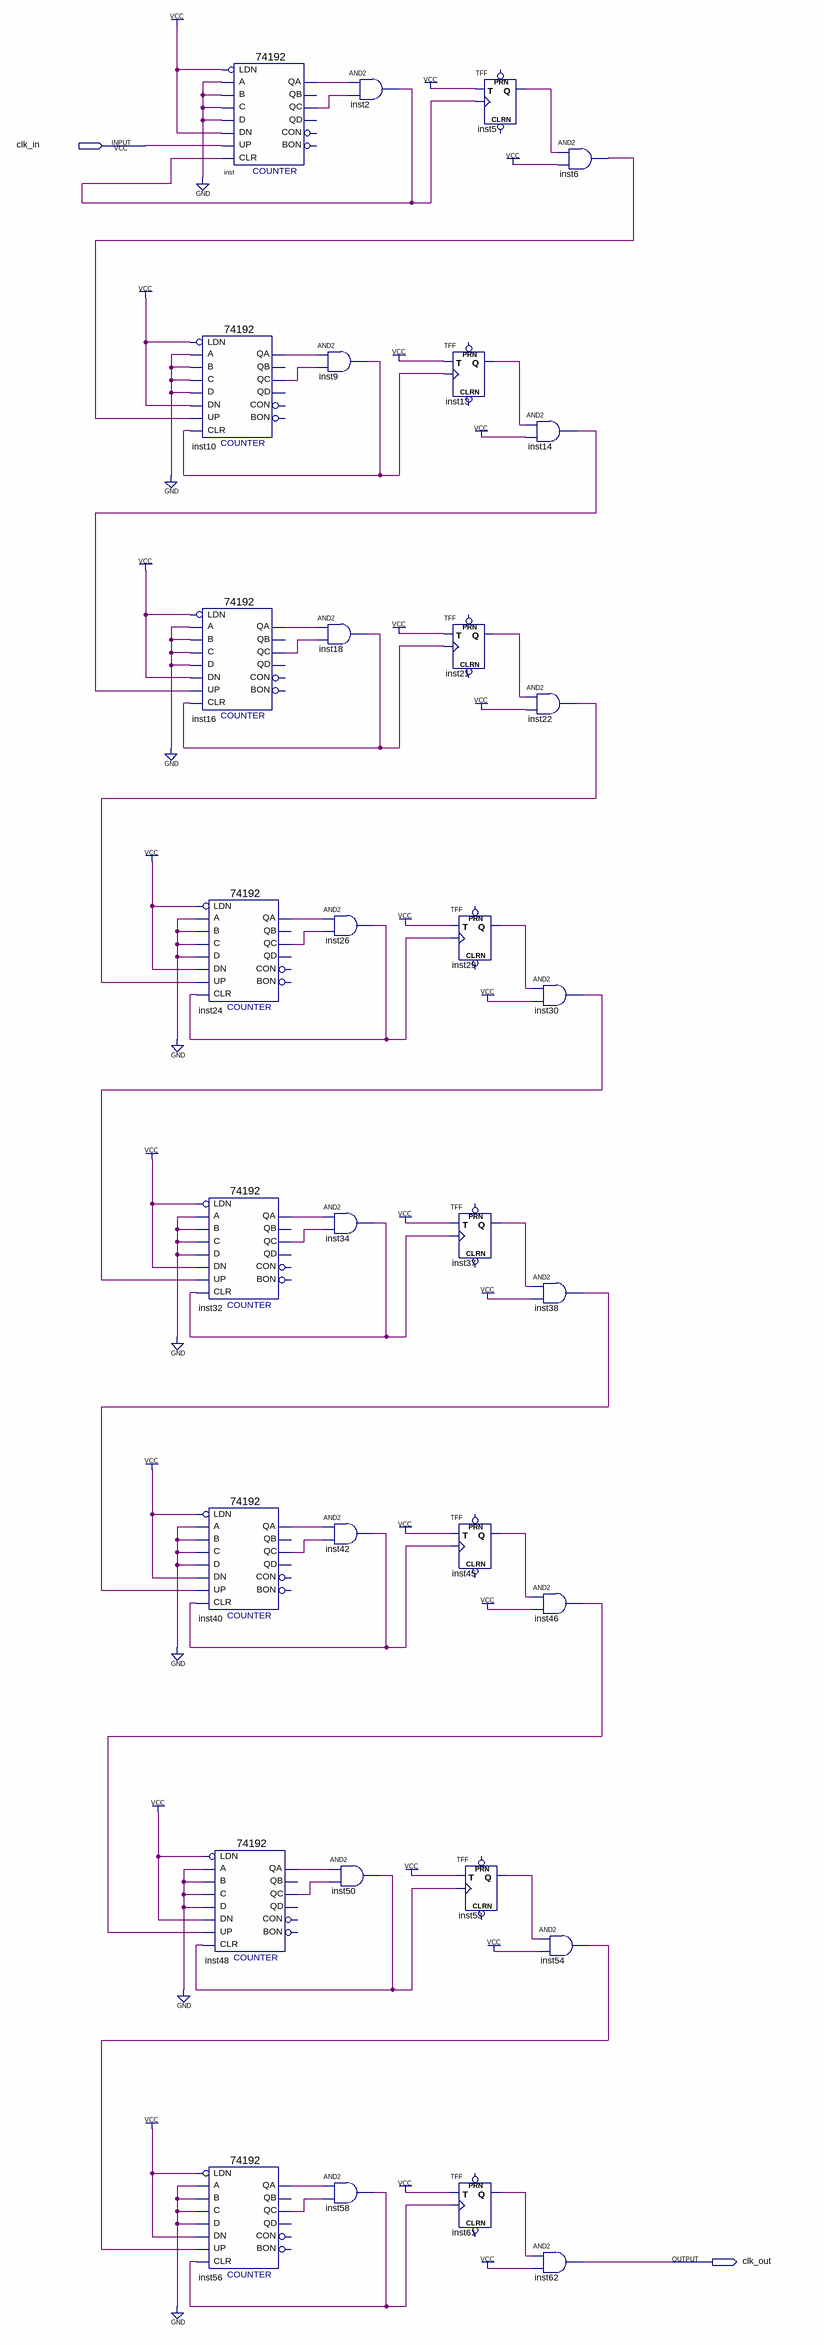
[diagram p0: schematic sheet]
// Quartus schematic fenpin.bdf as structural Verilog: 32 symbols, 2 pins
module fenpin (
  input  clk_in,
  output clk_out
);

  wire inst2_out, inst5_q, inst6_out, inst9_out, inst10_qa, inst10_qc, inst13_q, inst14_out, inst16_qa,
       inst16_qc, inst18_out, inst21_q, inst22_out, inst24_qa, inst24_qc, inst26_out, inst29_q, inst30_out,
       inst32_qa, inst32_qc, inst34_out, inst37_q, inst38_out, inst40_qa, inst40_qc, inst42_out, inst45_q,
       inst46_out, inst48_qa, inst48_qc, inst50_out, inst53_q, inst54_out, inst56_qa, inst56_qc, inst58_out,
       inst61_q, inst_qa, inst_qc;

  \74192  inst (
    .D(1'b0), .C(1'b0), .A(1'b0), .B(1'b0), .CLR(inst2_out), .UP(clk_in), .DN(1'b1), .LDN(1'b1),
    .QA(inst_qa), .QC(inst_qc));  // open: QB, BON, CON, QD
  \74192  inst10 (
    .D(1'b0), .C(1'b0), .A(1'b0), .B(1'b0), .CLR(inst9_out), .UP(inst6_out), .DN(1'b1), .LDN(1'b1),
    .QA(inst10_qa), .QC(inst10_qc));  // open: QB, BON, CON, QD
  \74192  inst16 (
    .D(1'b0), .C(1'b0), .A(1'b0), .B(1'b0), .CLR(inst18_out), .UP(inst14_out), .DN(1'b1), .LDN(1'b1),
    .QA(inst16_qa), .QC(inst16_qc));  // open: QB, BON, CON, QD
  \74192  inst24 (
    .D(1'b0), .C(1'b0), .A(1'b0), .B(1'b0), .CLR(inst26_out), .UP(inst22_out), .DN(1'b1), .LDN(1'b1),
    .QA(inst24_qa), .QC(inst24_qc));  // open: QB, BON, CON, QD
  \74192  inst32 (
    .D(1'b0), .C(1'b0), .A(1'b0), .B(1'b0), .CLR(inst34_out), .UP(inst30_out), .DN(1'b1), .LDN(1'b1),
    .QA(inst32_qa), .QC(inst32_qc));  // open: QB, BON, CON, QD
  \74192  inst40 (
    .D(1'b0), .C(1'b0), .A(1'b0), .B(1'b0), .CLR(inst42_out), .UP(inst38_out), .DN(1'b1), .LDN(1'b1),
    .QA(inst40_qa), .QC(inst40_qc));  // open: QB, BON, CON, QD
  \74192  inst48 (
    .D(1'b0), .C(1'b0), .A(1'b0), .B(1'b0), .CLR(inst50_out), .UP(inst46_out), .DN(1'b1), .LDN(1'b1),
    .QA(inst48_qa), .QC(inst48_qc));  // open: QB, BON, CON, QD
  \74192  inst56 (
    .D(1'b0), .C(1'b0), .A(1'b0), .B(1'b0), .CLR(inst58_out), .UP(inst54_out), .DN(1'b1), .LDN(1'b1),
    .QA(inst56_qa), .QC(inst56_qc));  // open: QB, BON, CON, QD
  and inst9 (inst9_out, inst10_qa, inst10_qc);
  and inst18 (inst18_out, inst16_qa, inst16_qc);
  and inst26 (inst26_out, inst24_qa, inst24_qc);
  and inst34 (inst34_out, inst32_qa, inst32_qc);
  and inst42 (inst42_out, inst40_qa, inst40_qc);
  and inst50 (inst50_out, inst48_qa, inst48_qc);
  and inst58 (inst58_out, inst56_qa, inst56_qc);
  and inst2 (inst2_out, inst_qa, inst_qc);
  TFF inst5 (.T(1'b1), .CLK(inst2_out), .Q(inst5_q));  // open: PRN, CLRN
  TFF inst13 (.T(1'b1), .CLK(inst9_out), .Q(inst13_q));  // open: PRN, CLRN
  TFF inst21 (.T(1'b1), .CLK(inst18_out), .Q(inst21_q));  // open: PRN, CLRN
  TFF inst29 (.T(1'b1), .CLK(inst26_out), .Q(inst29_q));  // open: PRN, CLRN
  TFF inst37 (.T(1'b1), .CLK(inst34_out), .Q(inst37_q));  // open: PRN, CLRN
  TFF inst45 (.T(1'b1), .CLK(inst42_out), .Q(inst45_q));  // open: PRN, CLRN
  TFF inst53 (.T(1'b1), .CLK(inst50_out), .Q(inst53_q));  // open: PRN, CLRN
  TFF inst61 (.T(1'b1), .CLK(inst58_out), .Q(inst61_q));  // open: PRN, CLRN
  and inst14 (inst14_out, inst13_q, 1'b1);
  and inst22 (inst22_out, inst21_q, 1'b1);
  and inst30 (inst30_out, inst29_q, 1'b1);
  and inst38 (inst38_out, inst37_q, 1'b1);
  and inst46 (inst46_out, inst45_q, 1'b1);
  and inst62 (clk_out, inst61_q, 1'b1);
  and inst6 (inst6_out, inst5_q, 1'b1);
  and inst54 (inst54_out, inst53_q, 1'b1);
endmodule
